# Altium schematic sheet Sheet2.SchDoc
size A3
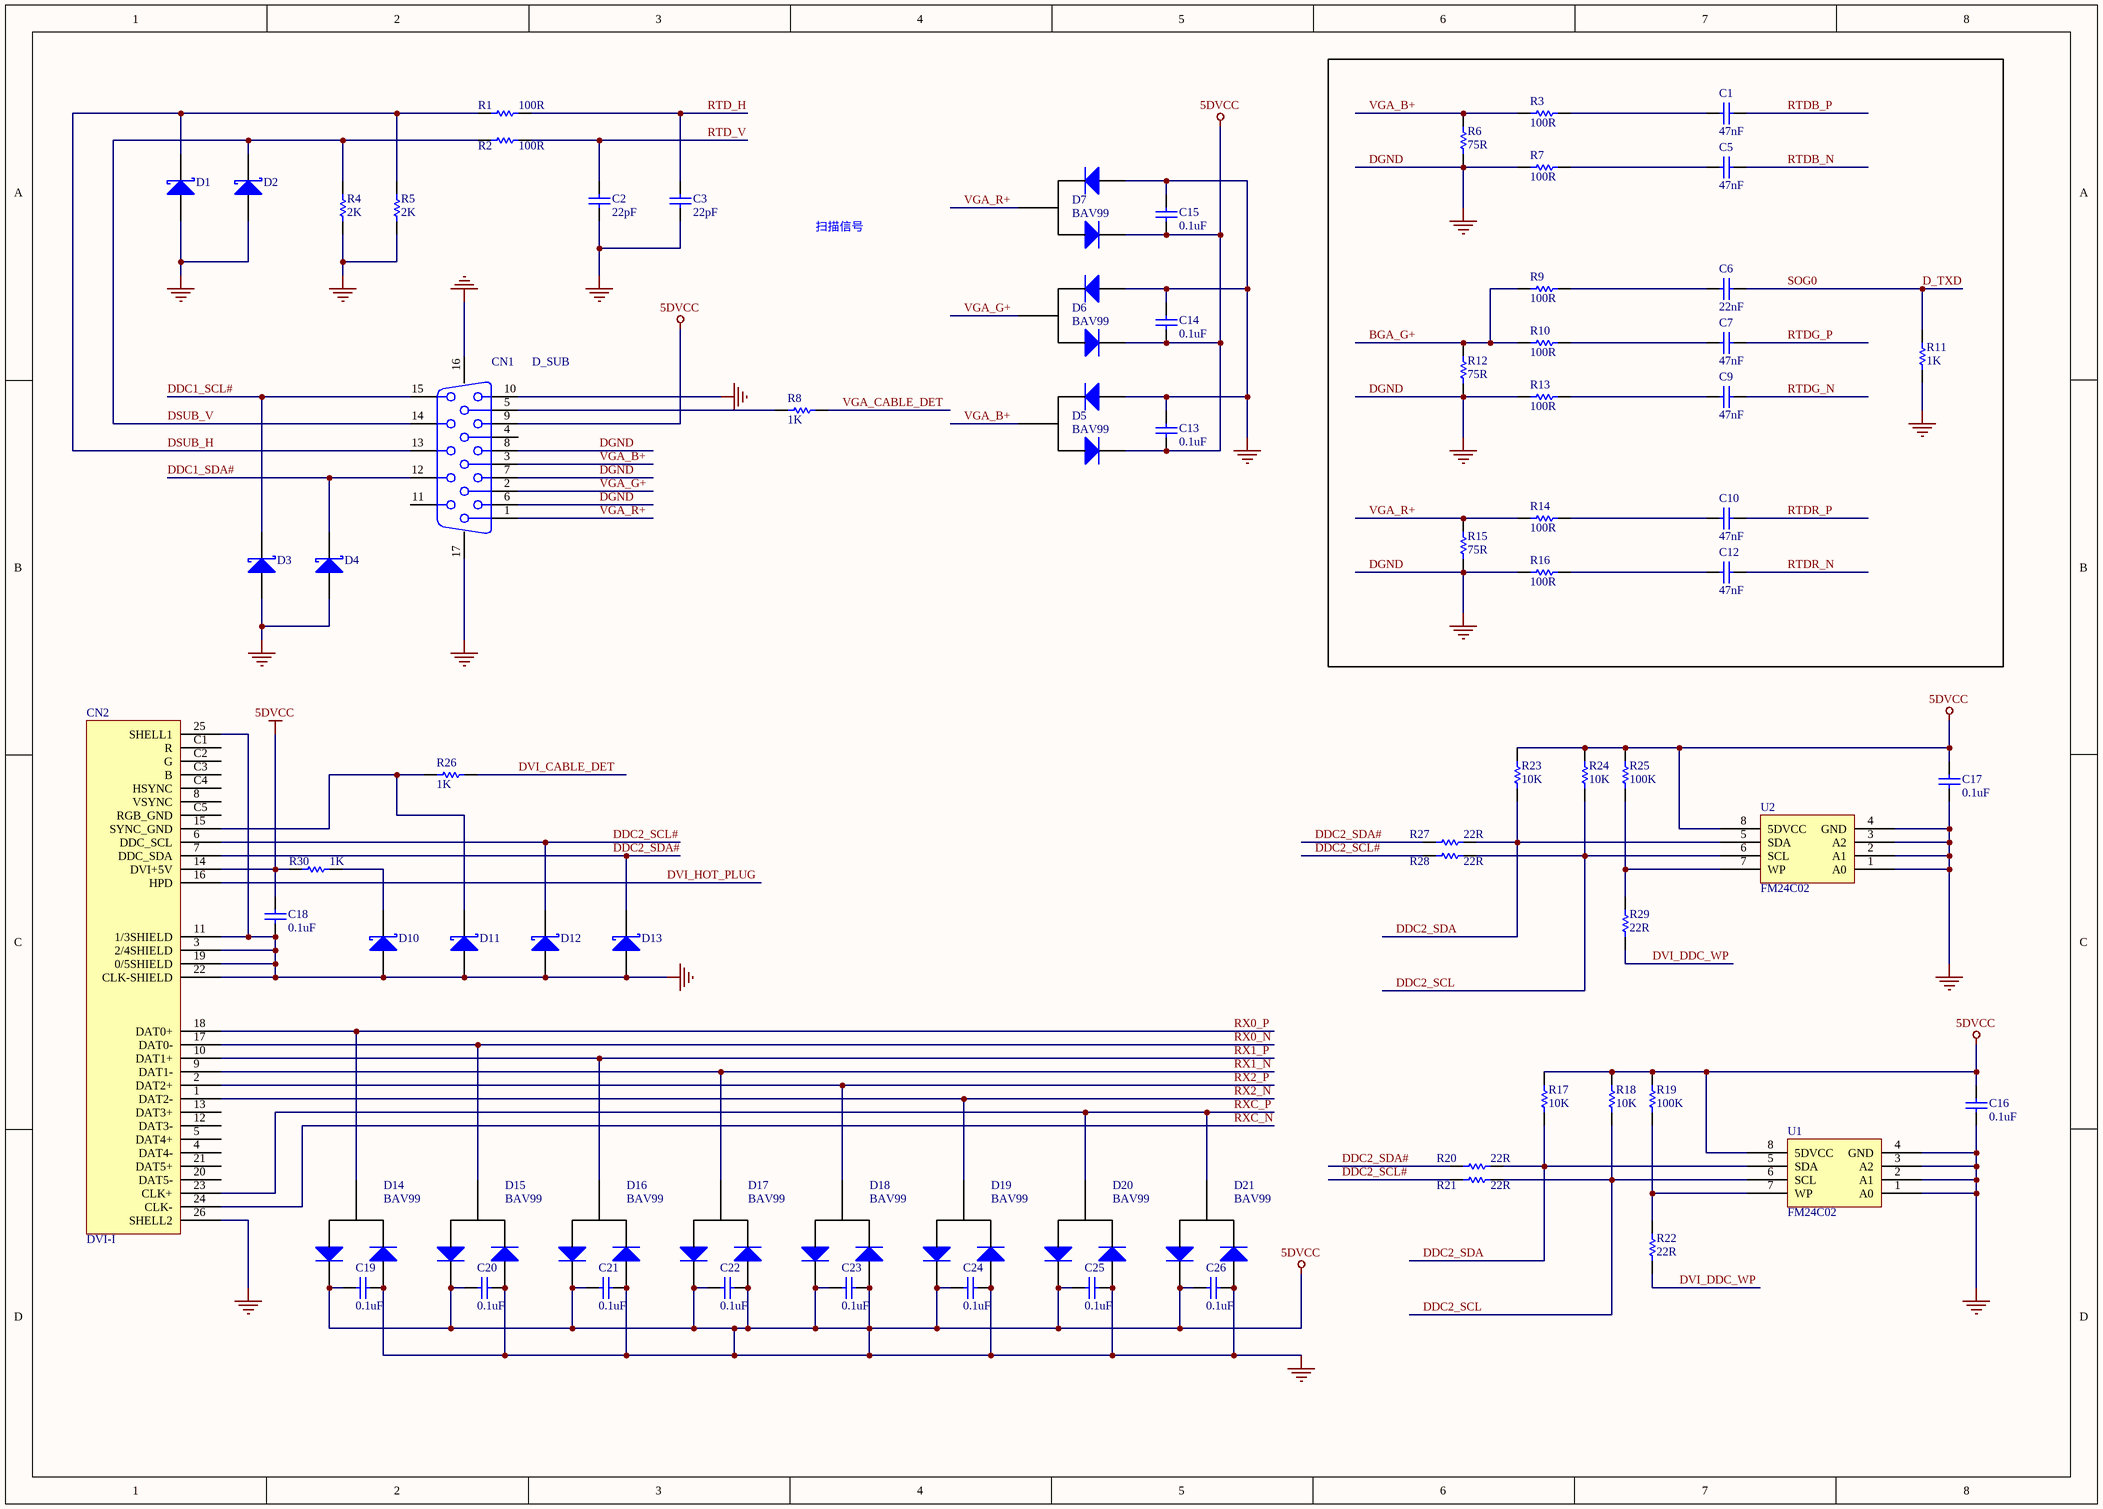
[diagram p0: Sheet2.SchDoc]

## Parts
C1  value 47nF  [C-0402]  (hidden comment: Cap)
C2  value 22pF  [C-0402]  (hidden comment: Cap)
C3  value 22pF  [C-0402]  (hidden comment: Cap)
C5  value 47nF  [C-0402]  (hidden comment: Cap)
C6  value 22nF  [C-0402]  (hidden comment: Cap)
C7  value 47nF  [C-0402]  (hidden comment: Cap)
C9  value 47nF  [C-0402]  (hidden comment: Cap)
C10  value 47nF  [C-0402]  (hidden comment: Cap)
C12  value 47nF  [C-0402]  (hidden comment: Cap)
C13  value 0.1uF  [C-0402]  (hidden comment: Cap)
C14  value 0.1uF  [C-0402]  (hidden comment: Cap)
C15  value 0.1uF  [C-0402]  (hidden comment: Cap)
C16  value 0.1uF  [C-0402]  (hidden comment: Cap)
C17  value 0.1uF  [C-0402]  (hidden comment: Cap)
C18  value 0.1uF  [C-0402]  (hidden comment: Cap)
C19  value 0.1uF  [C-0402]  (hidden comment: Cap)
C20  value 0.1uF  [C-0402]  (hidden comment: Cap)
C21  value 0.1uF  [C-0402]  (hidden comment: Cap)
C22  value 0.1uF  [C-0402]  (hidden comment: Cap)
C23  value 0.1uF  [C-0402]  (hidden comment: Cap)
C24  value 0.1uF  [C-0402]  (hidden comment: Cap)
C25  value 0.1uF  [C-0402]  (hidden comment: Cap)
C26  value 0.1uF  [C-0402]  (hidden comment: Cap)
CN1  D_SUB  [DSUB-W15]
CN2  DVI-I  [DVI-W24]
D1  Diode 10TQ035  [D-SOD323S]  (value not drawn)
D2  Diode 10TQ035  [D-SOD323S]  (value not drawn)
D3  Diode 10TQ035  [D-SOD323S]  (value not drawn)
D4  Diode 10TQ035  [D-SOD323S]  (value not drawn)
D5  BAV99  [Q-SOT23]
D6  BAV99  [Q-SOT23]
D7  BAV99  [Q-SOT23]
D10  Diode 10TQ035  [D-SOD323S]  (value not drawn)
D11  Diode 10TQ035  [D-SOD323S]  (value not drawn)
D12  Diode 10TQ035  [D-SOD323S]  (value not drawn)
D13  Diode 10TQ035  [D-SOD323S]  (value not drawn)
D14  BAV99  [Q-SOT23]
D15  BAV99  [Q-SOT23]
D16  BAV99  [Q-SOT23]
D17  BAV99  [Q-SOT23]
D18  BAV99  [Q-SOT23]
D19  BAV99  [Q-SOT23]
D20  BAV99  [Q-SOT23]
D21  BAV99  [Q-SOT23]
R1  value 100R  [R-0603]  (hidden comment: Res1)
R2  value 100R  [R-0603]  (hidden comment: Res1)
R3  value 100R  [R-0603]  (hidden comment: Res1)
R4  value 2K  [R-0603]  (hidden comment: Res1)
R5  value 2K  [R-0603]  (hidden comment: Res1)
R6  value 75R  [R-0603]  (hidden comment: Res1)
R7  value 100R  [R-0603]  (hidden comment: Res1)
R8  value 1K  [R-0603]  (hidden comment: Res1)
R9  value 100R  [R-0603]  (hidden comment: Res1)
R10  value 100R  [R-0603]  (hidden comment: Res1)
R11  value 1K  [R-0603]  (hidden comment: Res1)
R12  value 75R  [R-0603]  (hidden comment: Res1)
R13  value 100R  [R-0603]  (hidden comment: Res1)
R14  value 100R  [R-0603]  (hidden comment: Res1)
R15  value 75R  [R-0603]  (hidden comment: Res1)
R16  value 100R  [R-0603]  (hidden comment: Res1)
R17  value 10K  [R-0603]  (hidden comment: Res1)
R18  value 10K  [R-0603]  (hidden comment: Res1)
R19  value 100K  [R-0603]  (hidden comment: Res1)
R20  value 22R  [R-0603]  (hidden comment: Res1)
R21  value 22R  [R-0603]  (hidden comment: Res1)
R22  value 22R  [R-0603]  (hidden comment: Res1)
R23  value 10K  [R-0603]  (hidden comment: Res1)
R24  value 10K  [R-0603]  (hidden comment: Res1)
R25  value 100K  [R-0603]  (hidden comment: Res1)
R26  value 1K  [R-0603]  (hidden comment: Res1)
R27  value 22R  [R-0603]  (hidden comment: Res1)
R28  value 22R  [R-0603]  (hidden comment: Res1)
R29  value 22R  [R-0603]  (hidden comment: Res1)
R30  value 1K  [R-0603]  (hidden comment: Res1)
U1  FM24C02  [U-SOP/1.3]
U2  FM24C02  [U-SOP/1.3]

## Nets
DGND: C2.1 C3.1 C13.1 C13.2 C14.1 C14.2 C15.1 C15.2 C16.1 C16.2 C17.1 C17.2 C18.1 C18.2 C19.1 C19.2 C20.1 C20.2 C21.1 C21.2 C22.1 C22.2 C23.1 C23.2 C24.1 C24.2 C25.1 C25.2 C26.1 C26.2 CN1.6 CN1.7 CN1.8 CN1.9 CN1.10 CN1.16(MH1) CN1.17(MH2) CN2.3(2/4SHIELD) CN2.11(1/3SHIELD) CN2.14(DVI+5V) CN2.19(0/5SHIELD) CN2.22(CLK-SHIELD) CN2.25(SHELL1) CN2.26(SHELL2) D1.3(A) D2.3(A) D3.3(A) D4.3(A) D5.2 D5.3 D6.2 D6.3 D7.2 D7.3 D10.3(A) D11.3(A) D12.3(A) D13.3(A) D14.2 D14.3 D15.2 D15.3 D16.2 D16.3 D17.2 D17.3 D18.2 D18.3 D19.2 D19.3 D20.2 D20.3 D21.2 D21.3 R4.1 R5.1 R6.1 R7.1 R11.1 R12.1 R13.1 R15.1 R16.1 R17.2 R18.2 R19.2 R23.2 R24.2 R25.2 R30.1 U1.1(A0) U1.2(A1) U1.3(A2) U1.4(GND) U1.8(5DVCC) U2.1(A0) U2.2(A1) U2.3(A2) U2.4(GND) U2.8(5DVCC)  [also labelled 5DVCC, GND]
BGA_G+: R9.1 R10.1 R12.2
D_TXD: C6.2 R11.2  [also labelled SOG0]
DDC1_SCL#: CN1.15 D3.1(K)
DDC1_SDA#: CN1.12 D4.1(K)
DDC2_SCL: R18.1 R21.2 R24.1 R28.2 U1.6(SCL) U2.6(SCL)
DDC2_SCL#: CN2.6(DDC_SCL) D12.1(K) R21.1 R28.1
DDC2_SDA: R17.1 R20.2 R23.1 R27.2 U1.5(SDA) U2.5(SDA)
DDC2_SDA#: CN2.7(DDC_SDA) D13.1(K) R20.1 R27.1
DSUB_H: CN1.13 D1.1(K) R1.1 R5.2
DSUB_V: CN1.14 D2.1(K) R2.1 R4.2
DVI_CABLE_DET: R26.2
DVI_DDC_WP: R22.1 R29.1
DVI_HOT_PLUG: CN2.16(HPD)
RTD_H: C3.2 R1.2
RTD_V: C2.2 R2.2
RTDB_N: C5.2
RTDB_P: C1.2
RTDG_N: C9.2
RTDG_P: C7.2
RTDR_N: C12.2
RTDR_P: C10.2
RX0_N: CN2.17(DAT0-) D15.1
RX0_P: CN2.18(DAT0+) D14.1
RX1_N: CN2.9(DAT1-) D17.1
RX1_P: CN2.10(DAT1+) D16.1
RX2_N: CN2.1(DAT2-) D19.1
RX2_P: CN2.2(DAT2+) D18.1
RXC_N: CN2.24(CLK-)
RXC_P: CN2.23(CLK+) D20.1 D21.1
VGA_B+: CN1.3 D5.1 R3.1 R6.2
VGA_CABLE_DET: R8.2
VGA_G+: CN1.2 D6.1
VGA_R+: CN1.1 D7.1 R14.1 R15.2
NetC1_1: C1.1 R3.2
NetC5_1: C5.1 R7.2
NetC6_1: C6.1 R9.2
NetC7_1: C7.1 R10.2
NetC9_1: C9.1 R13.2
NetC10_1: C10.1 R14.2
NetC12_1: C12.1 R16.2
NetCN1_5: CN1.5 R8.1
NetCN2_15: CN2.15(SYNC_GND) D11.1(K) R26.1
NetD10_1: D10.1(K) R30.2
NetR19_1: R19.1 R22.2 U1.7(WP)
NetR25_1: R25.1 R29.2 U2.7(WP)

Not connected (* = marked no-connect by the designer): CN1 4 11; CN2 4(DAT4-) 5(DAT4+) 8(VSYNC) 12(DAT3-) 13(DAT3+) 20(DAT5-) 21(DAT5+) C1(R) C2(G) C3(B) C4(HSYNC) C5(RGB_GND)

## Notes on the sheet
- 扫描信号

## Library data of the parts
C1-C3 C5-C7 C9 C10 C12-C26 = Cap: Capacitor; Published: 8-Jun-2000; LatestRevisionDate: 17-Jul-2002; LatestRevisionNote: Re-released for DXP Platform.; PackageReference: RAD-0.3; Publisher: Altium Limited; PackageDescription: Radial Cap, Thru-Hole; 2 Leads; 0.3 in Pin Spacing
D1-D4 D10-D13 = Diode 10TQ035: Schottky Rectifier; Note: Terminal 2 is the TAB and is electrically connected to the cathode; Published: 8-Jun-2000; LatestRevisionDate: 17-Jul-2002; LatestRevisionNote: Re-released for DXP Platform.; DatasheetVersion: PD-2.057B; PackageVersion: Feb-1998; PackageReference: TO-220AC; Publisher: Altium Limited; PackageDescription: TO, Thru-Hole, Vertical, Heatsink Mounted; 3 In-Line Leads (1 Absent); Pitch 2.54 mm; ComponentLink1Description: Manufacturer Link; ComponentLink1URL: http://www.irf.com/; ComponentLink2Description: Datasheet; ComponentLink2URL: http://www.irf.com/product-info/datasheets/data/10tq.pdf
D5-D7 D14-D21 = DIODE
R1-R30 = Res1: Resistor; Published: 8-Jun-2000; LatestRevisionDate: 17-Jul-2002; LatestRevisionNote: Re-released for DXP Platform.; PackageReference: AXIAL-0.3; Publisher: Altium Limited; PackageDescription: Axial Device, Thru-Hole; 2 Leads; 0.3 in Pin Spacing